# EAGLE design RLC (EAGLE 6.4)
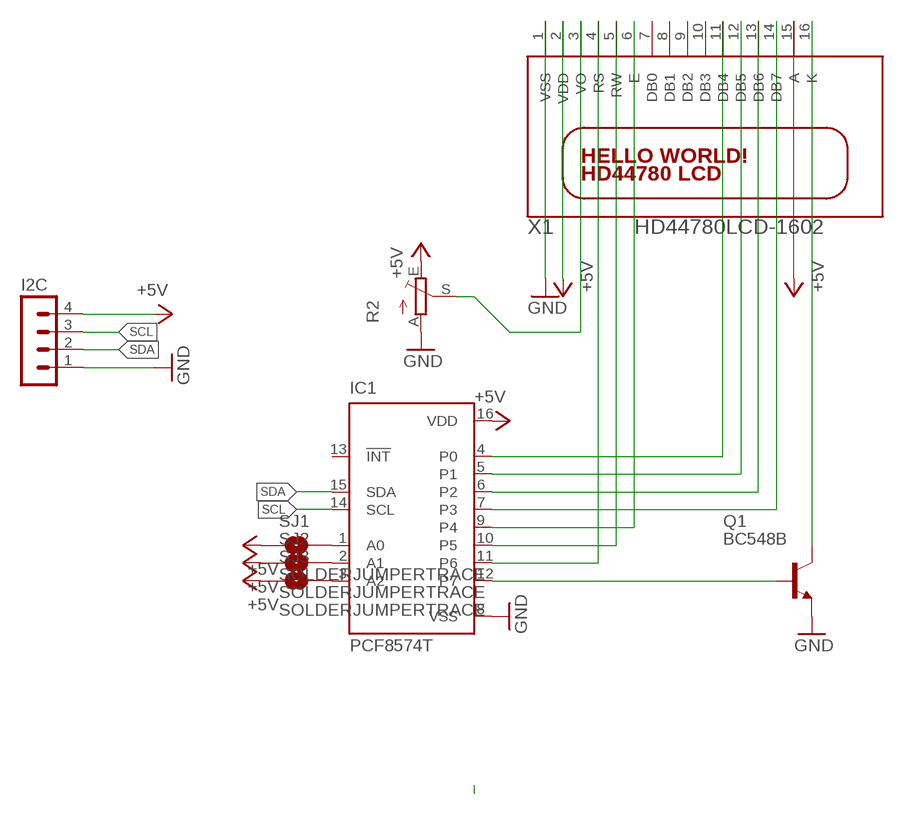
[diagram p0: schematic, sheet 1]

## Parts
I2C  MA04-1  [MA04-1]
IC1  PCF8574T  [SO16W]
Q1  BC548B  [TO92-EBC]
R2  TRIM_EU-CA6V  [CA6V]
SJ1  SOLDERJUMPERTRACE  [SJ_2S-TRACE]
SJ2  SOLDERJUMPERTRACE  [SJ_2S-TRACE]
SJ3  SOLDERJUMPERTRACE  [SJ_2S-TRACE]
X1  HD44780LCD-1602  [LCD1602]

## Nets
+5V: I2C.4 IC1.16(VDD) R2.E SJ1.1 SJ2.1 SJ3.1 X1.2(VDD) X1.15(A)
GND: I2C.1 IC1.8(VSS) Q1.E R2.A X1.1(VSS)
N$1: IC1.1(A0) SJ1.2
N$2: IC1.2(A1) SJ2.2
N$3: IC1.3(A2) SJ3.2
N$4: IC1.4(P0) X1.11(DB4)
N$5: IC1.5(P1) X1.12(DB5)
N$6: IC1.6(P2) X1.13(DB6)
N$7: IC1.7(P3) X1.14(DB7)
N$8: IC1.9(P4) X1.6(E)
N$9: IC1.10(P5) X1.5(RW)
N$10: IC1.11(P6) X1.4(RS)
N$11: IC1.12(P7) Q1.B
N$12: Q1.C X1.16(K)
N$13: R2.S X1.3(VO)
SCL: I2C.3 IC1.14(SCL)
SDA: I2C.2 IC1.15(SDA)
Unconnected: IC1.13(!INT) X1.7(DB0) X1.8(DB1) X1.9(DB2) X1.10(DB3)

## Library data of the parts
I2C = con-lstb:MA04-1: PIN HEADER; OC_FARNELL: unknown; OC_NEWARK: unknown
IC1 = micro-philips:PCF8574: I2C-Bus Remote 8-bit I/O expander http://www.semiconductors.philips.com/acrobat_download/datasheets/PCF8574_4.pdf; MPN: PCF8574T/3,512; OC_FARNELL: 1201255; OC_NEWARK: 70R6870
Q1 = transistor-npn:BC548*: NPN Transistor
R2 = pot:TRIM_EU-: POTENTIOMETER
SJ1-SJ3 = SparkFun:SOLDERJUMPER: Solder Jumper Standard SMD solder jumper. Used to automate production. Two varients : Normally Open and Normally Closed are the same, but have different paste layers. NC will have a large amount of paste and should jumper during reflow.
X1 = adafruit:HD44780LCD: HD44780 LCD Standard character type LCDs, available in sizes from 8x1 to 40x4!

## Board
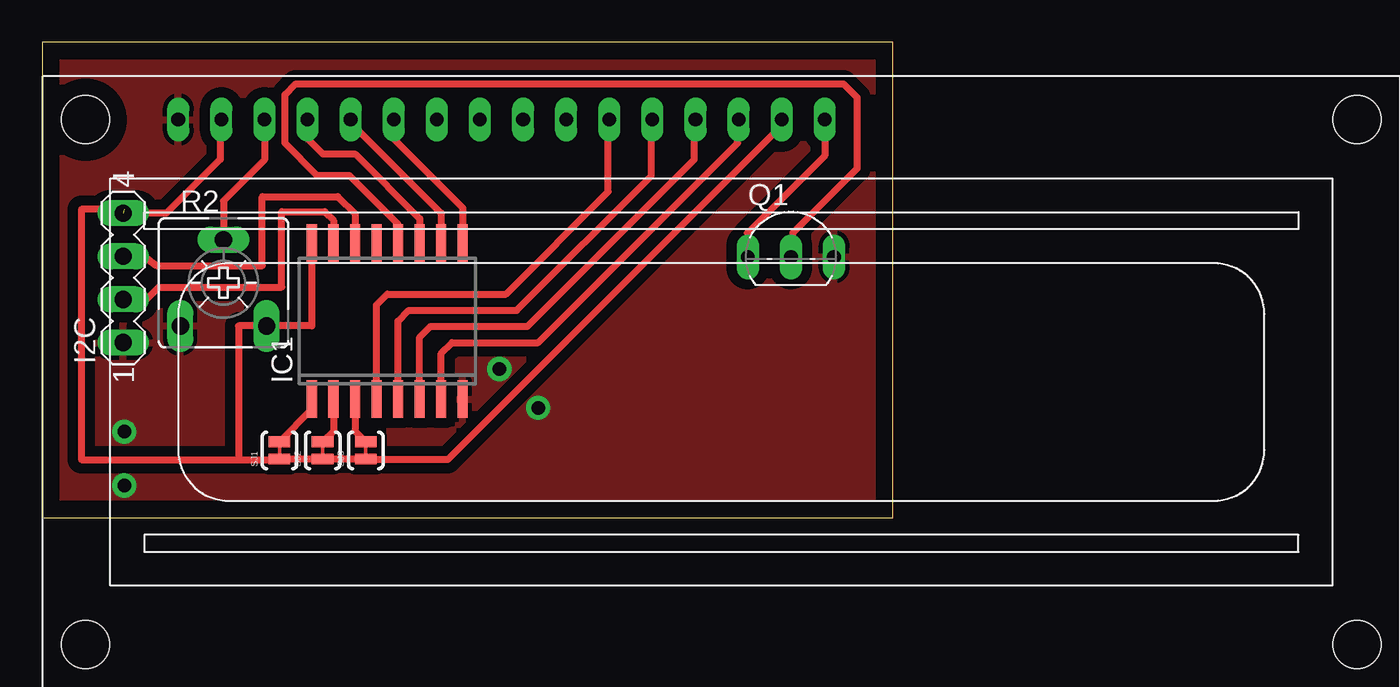
[diagram p1: board, top side]
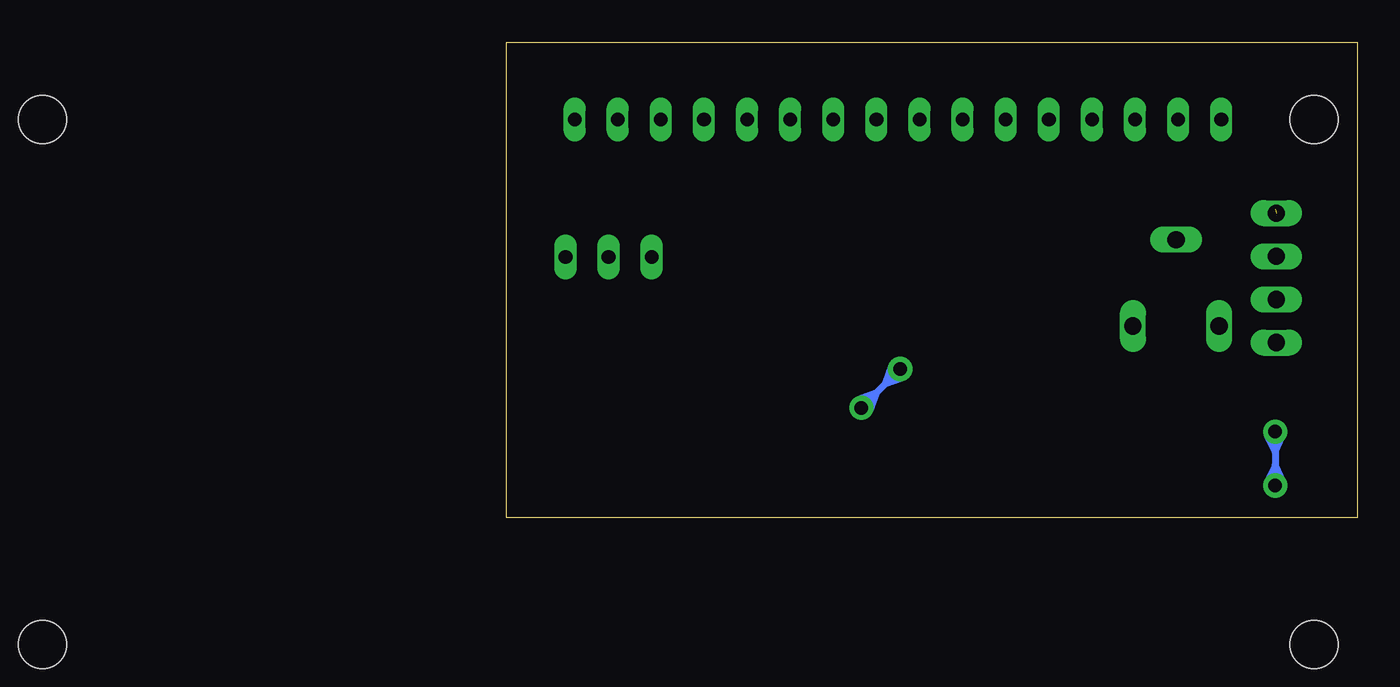
[diagram p2: board, bottom side, seen from below]

Size 50.13 x 28 mm. Coordinates in mm from the lower left corner, seen from the top.
Outline: 0,0 50.13,0 50.13,28 0,28 0,0
Copper layers (1*16): Top 0.035mm / dielectric 1.5mm / Bottom 0.035mm
Design rules "default": minimum track width 10mil, minimum drill 0.6mm, track to track 8mil, track to pad 8mil, pad to pad 8mil, via to via 8mil, smd to smd 8mil, copper to edge 40mil, drill to drill 8mil, minimum pad ring 10mil, minimum via ring 8mil, stop-mask expansion 4mil, vias tented up to drill 0mil, thermal gap 10mil

### Footprints (pad centres in the part's own frame; a part is rotated, then mirrored left to right if it is on the bottom)
MA04-1 = drill 1.016 long: 1 -3.81,0; 2 -1.27,0; 3 1.27,0; 4 3.81,0
SO16W = smd 0.6 x 2.2: 1 -4.445,-4.6; 2 -3.175,-4.6; 3 -1.905,-4.6; 4 -0.635,-4.6; 5 0.635,-4.6; 6 1.905,-4.6; 7 3.175,-4.6; 8 4.445,-4.6; 9 4.445,4.6; 10 3.175,4.6; 11 1.905,4.6; 12 0.635,4.6; 13 -0.635,4.6; 14 -1.905,4.6; 15 -3.175,4.6; 16 -4.445,4.6
TO92-EBC = drill 0.813 long: B 0,-1.27; C -2.54,-1.27; E 2.54,-1.27
CA6V = drill 1.016 long: A -2.54,-2.54; E 2.54,-2.54; S 0,2.54
SJ_2S-TRACE = smd 0.635 x 1.27: 1 -0.508,0; 2 0.508,0
LCD1602 = drill 0.8 long: 1 8,33.46; 2 10.54,33.46; 3 13.08,33.46; 4 15.62,33.46; 5 18.16,33.46; 6 20.7,33.46; 7 23.24,33.46; 8 25.78,33.46; 9 28.32,33.46; 10 30.86,33.46; 11 33.4,33.46; 12 35.94,33.46; 13 38.48,33.46; 14 41.02,33.46; 15 43.56,33.46; 16 46.1,33.46 | hole 2.8: 2.54,2.54; 2.54,33.46; 77.46,33.46; 77.46,2.54

### Placement (x,y rotation side)
I2C  4.76,14.13 90 top
IC1  20.32,11.59 0 top
Q1  44.1,16.64 0 top
R2  10.67,13.84 0 top
SJ1  13.97,3.97 90 top
SJ2  16.51,3.97 90 top
SJ3  19.05,3.97 90 top
X1  0,-10 0 top

### Tracks (layer width: path | path; a pad name or v marks a point on that pad's centre or on a via)
+5V  (1 unrouted)
  Top 0.406: X1.15 43.18,23.08 43.18,22.73 23.88,3.43 19.08,3.43 SJ3.1 SJ2.1 SJ1.1 13.97,3.43 11.56,3.43 | X1.2 10.48,23.4 10.48,21.11 7.3,17.94 I2C.4 | IC1.16 15.88,11.3 R2.E 11.56,11.3 11.56,3.43 | 4.83,18.16 2.29,18.16 2.29,3.43 11.56,3.43
GND  (via drill 0.8 pad 1.42)
  Bottom 0.406: v4.83,5.08 4.83,3.88 | 4.83,3.88 4.83,3.1 | 4.83,3.1 v4.83,1.91 | v26.92,8.76 27.77,7.91 | 27.77,7.91 28.36,7.33 | 28.36,7.33 v29.21,6.48 | 4.83,3.88 5.29,4.87 v4.83,5.08 | 4.83,3.88 4.37,4.87 v4.83,5.08 | 4.83,3.1 4.37,2.12 v4.83,1.91 | 4.83,3.1 5.29,2.12 v4.83,1.91 | 27.77,7.91 27.4,8.94 v26.92,8.76 | 27.77,7.91 26.75,8.29 v26.92,8.76 | 28.36,7.33 28.73,6.3 v29.21,6.48 | 28.36,7.33 29.38,6.96 v29.21,6.48
  pour Top (isolate 0.61): -1.27,37.47 100.65,37.47 100.65,-0.64 -1.27,-0.64
N$1
  Top 0.406: IC1.1 15.88,6.38 SJ1.2
N$2
  Top 0.406: IC1.2 17.14,5.11 SJ2.2
N$3
  Top 0.406: IC1.3 18.41,5.11 SJ3.2
N$4
  Top 0.406: IC1.4 19.68,12.54 20.32,13.18 27.3,13.18 33.34,19.21 33.34,23.4 X1.11
N$5
  Top 0.406: IC1.5 20.95,11.59 21.59,12.22 27.94,12.22 35.88,20.16 35.88,23.4 X1.12
N$6
  Top 0.406: IC1.6 22.23,10.64 22.86,11.27 28.57,11.27 38.42,21.11 38.42,23.4 X1.13
N$7
  Top 0.406: IC1.7 23.5,9.69 24.13,10.32 29.21,10.32 40.96,22.07 40.96,23.4 X1.14
N$8
  Top 0.406: X1.6 20.7,22.32 24.77,18.26 IC1.9
N$9
  Top 0.406: X1.5 18.16,23.27 23.5,17.94 IC1.10
N$10
  Top 0.406: X1.4 15.62,22.32 16.51,21.43 18.41,21.43 22.23,17.62 IC1.11
N$11
  Top 0.406: IC1.12 20.95,17.3 18.1,20.16 16.19,20.16 14.29,22.07 14.29,24.93 14.92,25.56 47.21,25.56 48.01,24.77 48.01,20.57 44.2,16.76 44.2,15.46 Q1.B
N$12
  Top 0.406: X1.16 46.1,21.34 41.53,16.76 41.53,15.4 Q1.C
N$13
  Top 0.406: X1.3 13.08,21.08 10.67,18.67 R2.S
SCL
  Top 0.406: I2C.3 6,15.4 6.73,14.86 12.95,14.86 12.95,18.92 17.4,18.92 18.41,17.91 IC1.14
SDA
  Top 0.406: I2C.2 6.13,12.86 6.86,13.59 14.1,13.59 14.1,18.03 16.64,18.03 17.14,17.53 IC1.15